# Altium schematic sheet Pressure_ADIN.SchDoc
size A4
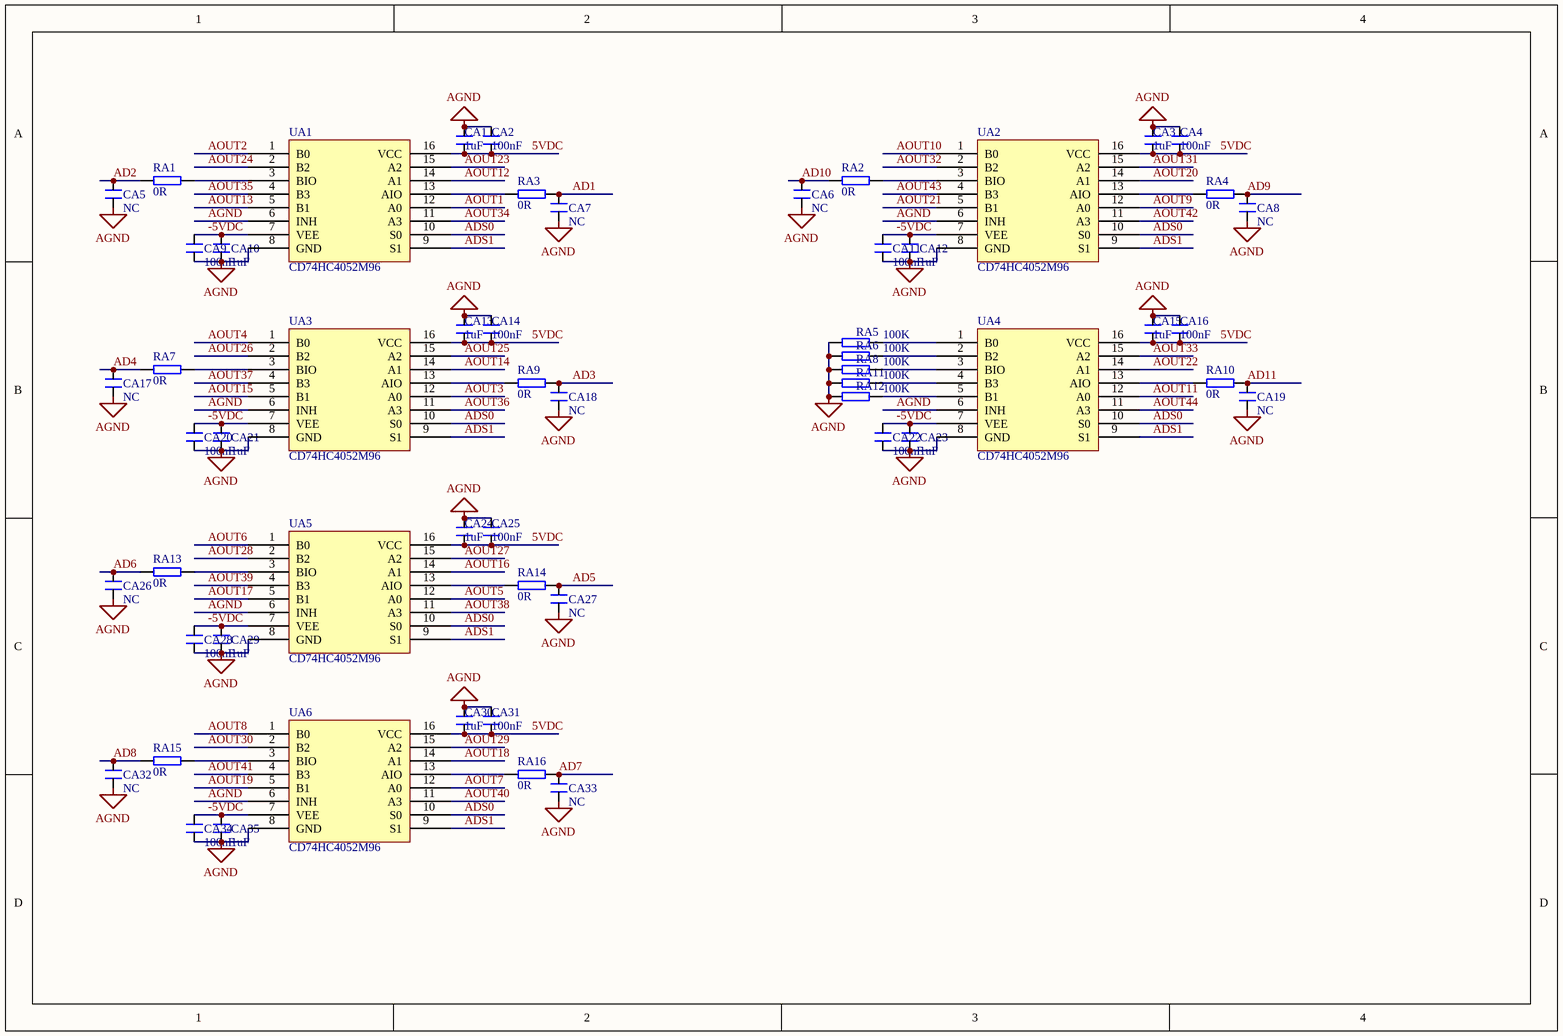
[diagram p0: Pressure_ADIN.SchDoc]

## Parts
CA1  1uF  [C0603_HSC100]
CA2  100nF  [C0603_HSC100]
CA3  1uF  [C0603_HSC100]
CA4  100nF  [C0603_HSC100]
CA5  NC  [C0603_HSC100]
CA6  NC  [C0603_HSC100]
CA7  NC  [C0603_HSC100]
CA8  NC  [C0603_HSC100]
CA9  100nF  [C0603_HSC100]
CA10  1uF  [C0603_HSC100]
CA11  100nF  [C0603_HSC100]
CA12  1uF  [C0603_HSC100]
CA13  1uF  [C0603_HSC100]
CA14  100nF  [C0603_HSC100]
CA15  1uF  [C0603_HSC100]
CA16  100nF  [C0603_HSC100]
CA17  NC  [C0603_HSC100]
CA18  NC  [C0603_HSC100]
CA19  NC  [C0603_HSC100]
CA20  100nF  [C0603_HSC100]
CA21  1uF  [C0603_HSC100]
CA22  100nF  [C0603_HSC100]
CA23  1uF  [C0603_HSC100]
CA24  1uF  [C0603_HSC100]
CA25  100nF  [C0603_HSC100]
CA26  NC  [C0603_HSC100]
CA27  NC  [C0603_HSC100]
CA28  100nF  [C0603_HSC100]
CA29  1uF  [C0603_HSC100]
CA30  1uF  [C0603_HSC100]
CA31  100nF  [C0603_HSC100]
CA32  NC  [C0603_HSC100]
CA33  NC  [C0603_HSC100]
CA34  100nF  [C0603_HSC100]
CA35  1uF  [C0603_HSC100]
RA1  0R  [R0603_HSC100]
RA2  0R  [R0603_HSC100]
RA3  0R  [R0603_HSC100]
RA4  0R  [R0603_HSC100]
RA5  100K  [R0603_HSC100]
RA6  100K  [R0603_HSC100]
RA7  0R  [R0603_HSC100]
RA8  100K  [R0603_HSC100]
RA9  0R  [R0603_HSC100]
RA10  0R  [R0603_HSC100]
RA11  100K  [R0603_HSC100]
RA12  100K  [R0603_HSC100]
RA13  0R  [R0603_HSC100]
RA14  0R  [R0603_HSC100]
RA15  0R  [R0603_HSC100]
RA16  0R  [R0603_HSC100]
UA1  CD74HC4052M96  [SO-16]
UA2  CD74HC4052M96  [SO-16]
UA3  CD74HC4052M96  [SO-16]
UA4  CD74HC4052M96  [SO-16]
UA5  CD74HC4052M96  [SO-16]
UA6  CD74HC4052M96  [SO-16]

## Nets
AGND: CA1.1 CA2.1 CA3.1 CA4.1 CA5.1 CA6.1 CA7.1 CA8.1 CA9.1 CA10.1 CA11.1 CA12.1 CA13.1 CA14.1 CA15.1 CA16.1 CA17.1 CA18.1 CA19.1 CA20.1 CA21.1 CA22.1 CA23.1 CA24.1 CA25.1 CA26.1 CA27.1 CA28.1 CA29.1 CA30.1 CA31.1 CA32.1 CA33.1 CA34.1 CA35.1 RA5.1 RA6.1 RA8.1 RA11.1 RA12.1 UA1.6(INH) UA1.8(GND) UA2.6(INH) UA2.8(GND) UA3.6(INH) UA3.8(GND) UA4.6(INH) UA4.8(GND) UA5.6(INH) UA5.8(GND) UA6.6(INH) UA6.8(GND)
5VDC: CA1.2 CA2.2 CA3.2 CA4.2 CA13.2 CA14.2 CA15.2 CA16.2 CA24.2 CA25.2 CA30.2 CA31.2 UA1.16(VCC) UA2.16(VCC) UA3.16(VCC) UA4.16(VCC) UA5.16(VCC) UA6.16(VCC)
-5VDC: CA9.2 CA10.2 CA11.2 CA12.2 CA20.2 CA21.2 CA22.2 CA23.2 CA28.2 CA29.2 CA34.2 CA35.2 UA1.7(VEE) UA2.7(VEE) UA3.7(VEE) UA4.7(VEE) UA5.7(VEE) UA6.7(VEE)
AD1: CA7.2 RA3.1
AD2: CA5.2 RA1.2
AD3: CA18.2 RA9.1
AD4: CA17.2 RA7.2
AD5: CA27.2 RA14.1
AD6: CA26.2 RA13.2
AD7: CA33.2 RA16.1
AD8: CA32.2 RA15.2
AD9: CA8.2 RA4.1
AD10: CA6.2 RA2.2
AD11: CA19.2 RA10.1
ADS0: UA1.10(S0) UA2.10(S0) UA3.10(S0) UA4.10(S0) UA5.10(S0) UA6.10(S0)
ADS1: UA1.9(S1) UA2.9(S1) UA3.9(S1) UA4.9(S1) UA5.9(S1) UA6.9(S1)
AOUT1: UA1.12(A0)
AOUT2: UA1.1(B0)
AOUT3: UA3.12(A0)
AOUT4: UA3.1(B0)
AOUT5: UA5.12(A0)
AOUT6: UA5.1(B0)
AOUT7: UA6.12(A0)
AOUT8: UA6.1(B0)
AOUT9: UA2.12(A0)
AOUT10: UA2.1(B0)
AOUT11: UA4.12(A0)
AOUT12: UA1.14(A1)
AOUT13: UA1.5(B1)
AOUT14: UA3.14(A1)
AOUT15: UA3.5(B1)
AOUT16: UA5.14(A1)
AOUT17: UA5.5(B1)
AOUT18: UA6.14(A1)
AOUT19: UA6.5(B1)
AOUT20: UA2.14(A1)
AOUT21: UA2.5(B1)
AOUT22: UA4.14(A1)
AOUT23: UA1.15(A2)
AOUT24: UA1.2(B2)
AOUT25: UA3.15(A2)
AOUT26: UA3.2(B2)
AOUT27: UA5.15(A2)
AOUT28: UA5.2(B2)
AOUT29: UA6.15(A2)
AOUT30: UA6.2(B2)
AOUT31: UA2.15(A2)
AOUT32: UA2.2(B2)
AOUT33: UA4.15(A2)
AOUT34: UA1.11(A3)
AOUT35: UA1.4(B3)
AOUT36: UA3.11(A3)
AOUT37: UA3.4(B3)
AOUT38: UA5.11(A3)
AOUT39: UA5.4(B3)
AOUT40: UA6.11(A3)
AOUT41: UA6.4(B3)
AOUT42: UA2.11(A3)
AOUT43: UA2.4(B3)
AOUT44: UA4.11(A3)
NetRA1_1: RA1.1 UA1.3(BIO)
NetRA2_1: RA2.1 UA2.3(BIO)
NetRA3_2: RA3.2 UA1.13(AIO)
NetRA4_2: RA4.2 UA2.13(AIO)
NetRA5_2: RA5.2 UA4.1(B0)
NetRA6_2: RA6.2 UA4.2(B2)
NetRA7_1: RA7.1 UA3.3(BIO)
NetRA8_2: RA8.2 UA4.3(BIO)
NetRA9_2: RA9.2 UA3.13(AIO)
NetRA10_2: RA10.2 UA4.13(AIO)
NetRA11_2: RA11.2 UA4.4(B3)
NetRA12_2: RA12.2 UA4.5(B1)
NetRA13_1: RA13.1 UA5.3(BIO)
NetRA14_2: RA14.2 UA5.13(AIO)
NetRA15_1: RA15.1 UA6.3(BIO)
NetRA16_2: RA16.2 UA6.13(AIO)

## Library data of the parts
CA1-CA35 = CAP_M
RA1-RA16 = RES
UA1-UA6 = 74HC4052